# Altium schematic sheet overviewSchematic.SchDoc
size A; SheetNumber: 1; SheetTotal: 14
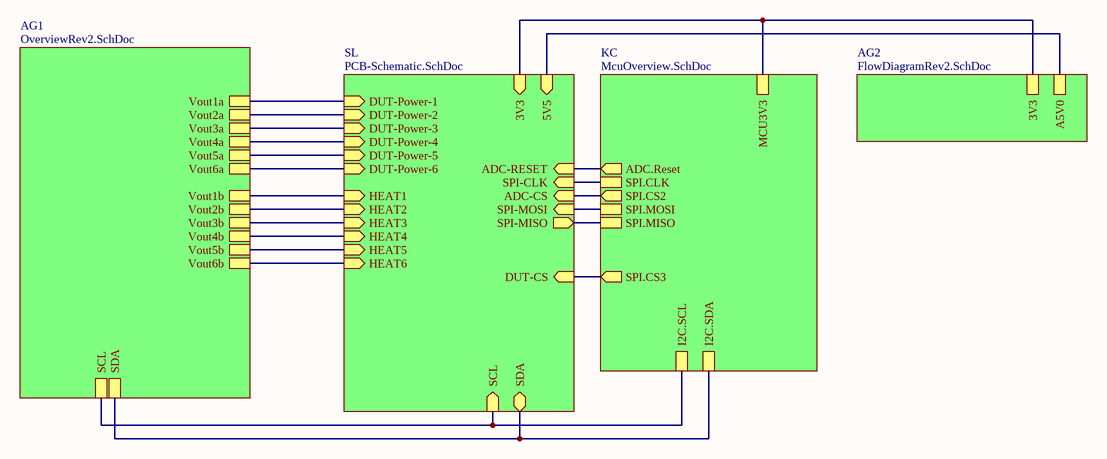
[diagram p0: overviewSchematic.SchDoc]

## Sub-sheets
AG1 = OverviewRev2.SchDoc: Vout4a, Vout5a, Vout6a, Vout4b, Vout5b, Vout6b, Vout1a, Vout1b, Vout2a, Vout2b, Vout3b, Vout3a, SCL, SDA
AG2 = FlowDiagramRev2.SchDoc: 3V3, A5V0
KC = McuOverview.SchDoc: I2C.SDA, I2C.SCL, SPI.CS3 (out), MCU3V3, SPI.CLK, SPI.MISO, SPI.MOSI, ADC.Reset (out), SPI.CS2 (out)
SL = PCB-Schematic.SchDoc: DUT-Power-1 (in), DUT-Power-2 (in), DUT-Power-3 (in), DUT-Power-4 (in), DUT-Power-5 (in), DUT-Power-6 (in), HEAT1 (in), HEAT2 (in), HEAT3 (in), HEAT4 (in), HEAT5 (in), HEAT6 (in), ADC-CS (in), SPI-MOSI (in), SPI-MISO (out), ADC-RESET (in), SPI-CLK (in), SDA (bidir), SCL (in), DUT-CS (in), 3V3 (in), 5V5 (in)

## Nets
(unnamed): sheet KC/I2C.SDA, sheet SL/SDA, sheet AG1/SDA
(unnamed): sheet KC/I2C.SCL, sheet SL/SCL, sheet AG1/SCL
(unnamed): sheet KC/SPI.CS3, sheet SL/DUT-CS
(unnamed): sheet KC/MCU3V3, sheet SL/3V3, sheet AG2/3V3
(unnamed): sheet KC/SPI.CLK, sheet SL/SPI-CLK
(unnamed): sheet KC/SPI.MISO, sheet SL/SPI-MISO
(unnamed): sheet KC/SPI.MOSI, sheet SL/SPI-MOSI
(unnamed): sheet KC/ADC.Reset, sheet SL/ADC-RESET
(unnamed): sheet KC/SPI.CS2, sheet SL/ADC-CS
(unnamed): sheet SL/DUT-Power-1, sheet AG1/Vout1a
(unnamed): sheet SL/DUT-Power-2, sheet AG1/Vout2a
(unnamed): sheet SL/DUT-Power-3, sheet AG1/Vout3a
(unnamed): sheet SL/DUT-Power-4, sheet AG1/Vout4a
(unnamed): sheet SL/DUT-Power-5, sheet AG1/Vout5a
(unnamed): sheet SL/DUT-Power-6, sheet AG1/Vout6a
(unnamed): sheet SL/HEAT1, sheet AG1/Vout1b
(unnamed): sheet SL/HEAT2, sheet AG1/Vout2b
(unnamed): sheet SL/HEAT3, sheet AG1/Vout3b
(unnamed): sheet SL/HEAT4, sheet AG1/Vout4b
(unnamed): sheet SL/HEAT5, sheet AG1/Vout5b
(unnamed): sheet SL/HEAT6, sheet AG1/Vout6b
(unnamed): sheet SL/5V5, sheet AG2/A5V0